# EAGLE schematic IO (EAGLE 9.4.2)

## Sheet 1 of 2
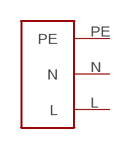
[diagram p0: schematic, sheet 1]

### Parts
U$1  DD21  [DD21.NOCOVER]
Unconnected: U$1.L U$1.N U$1.PE

## Sheet 2 of 2

## Library data of the parts
U$1 = Vwvwbg:DD21